# Altium schematic sheet S7CAS-PLEIADES-CARTE-MERE_P06_POWER.SCHDOC
size Tabloid; SheetNumber: 4; SheetTotal: 18; Sheet_Name: POWER; Size: 11x17
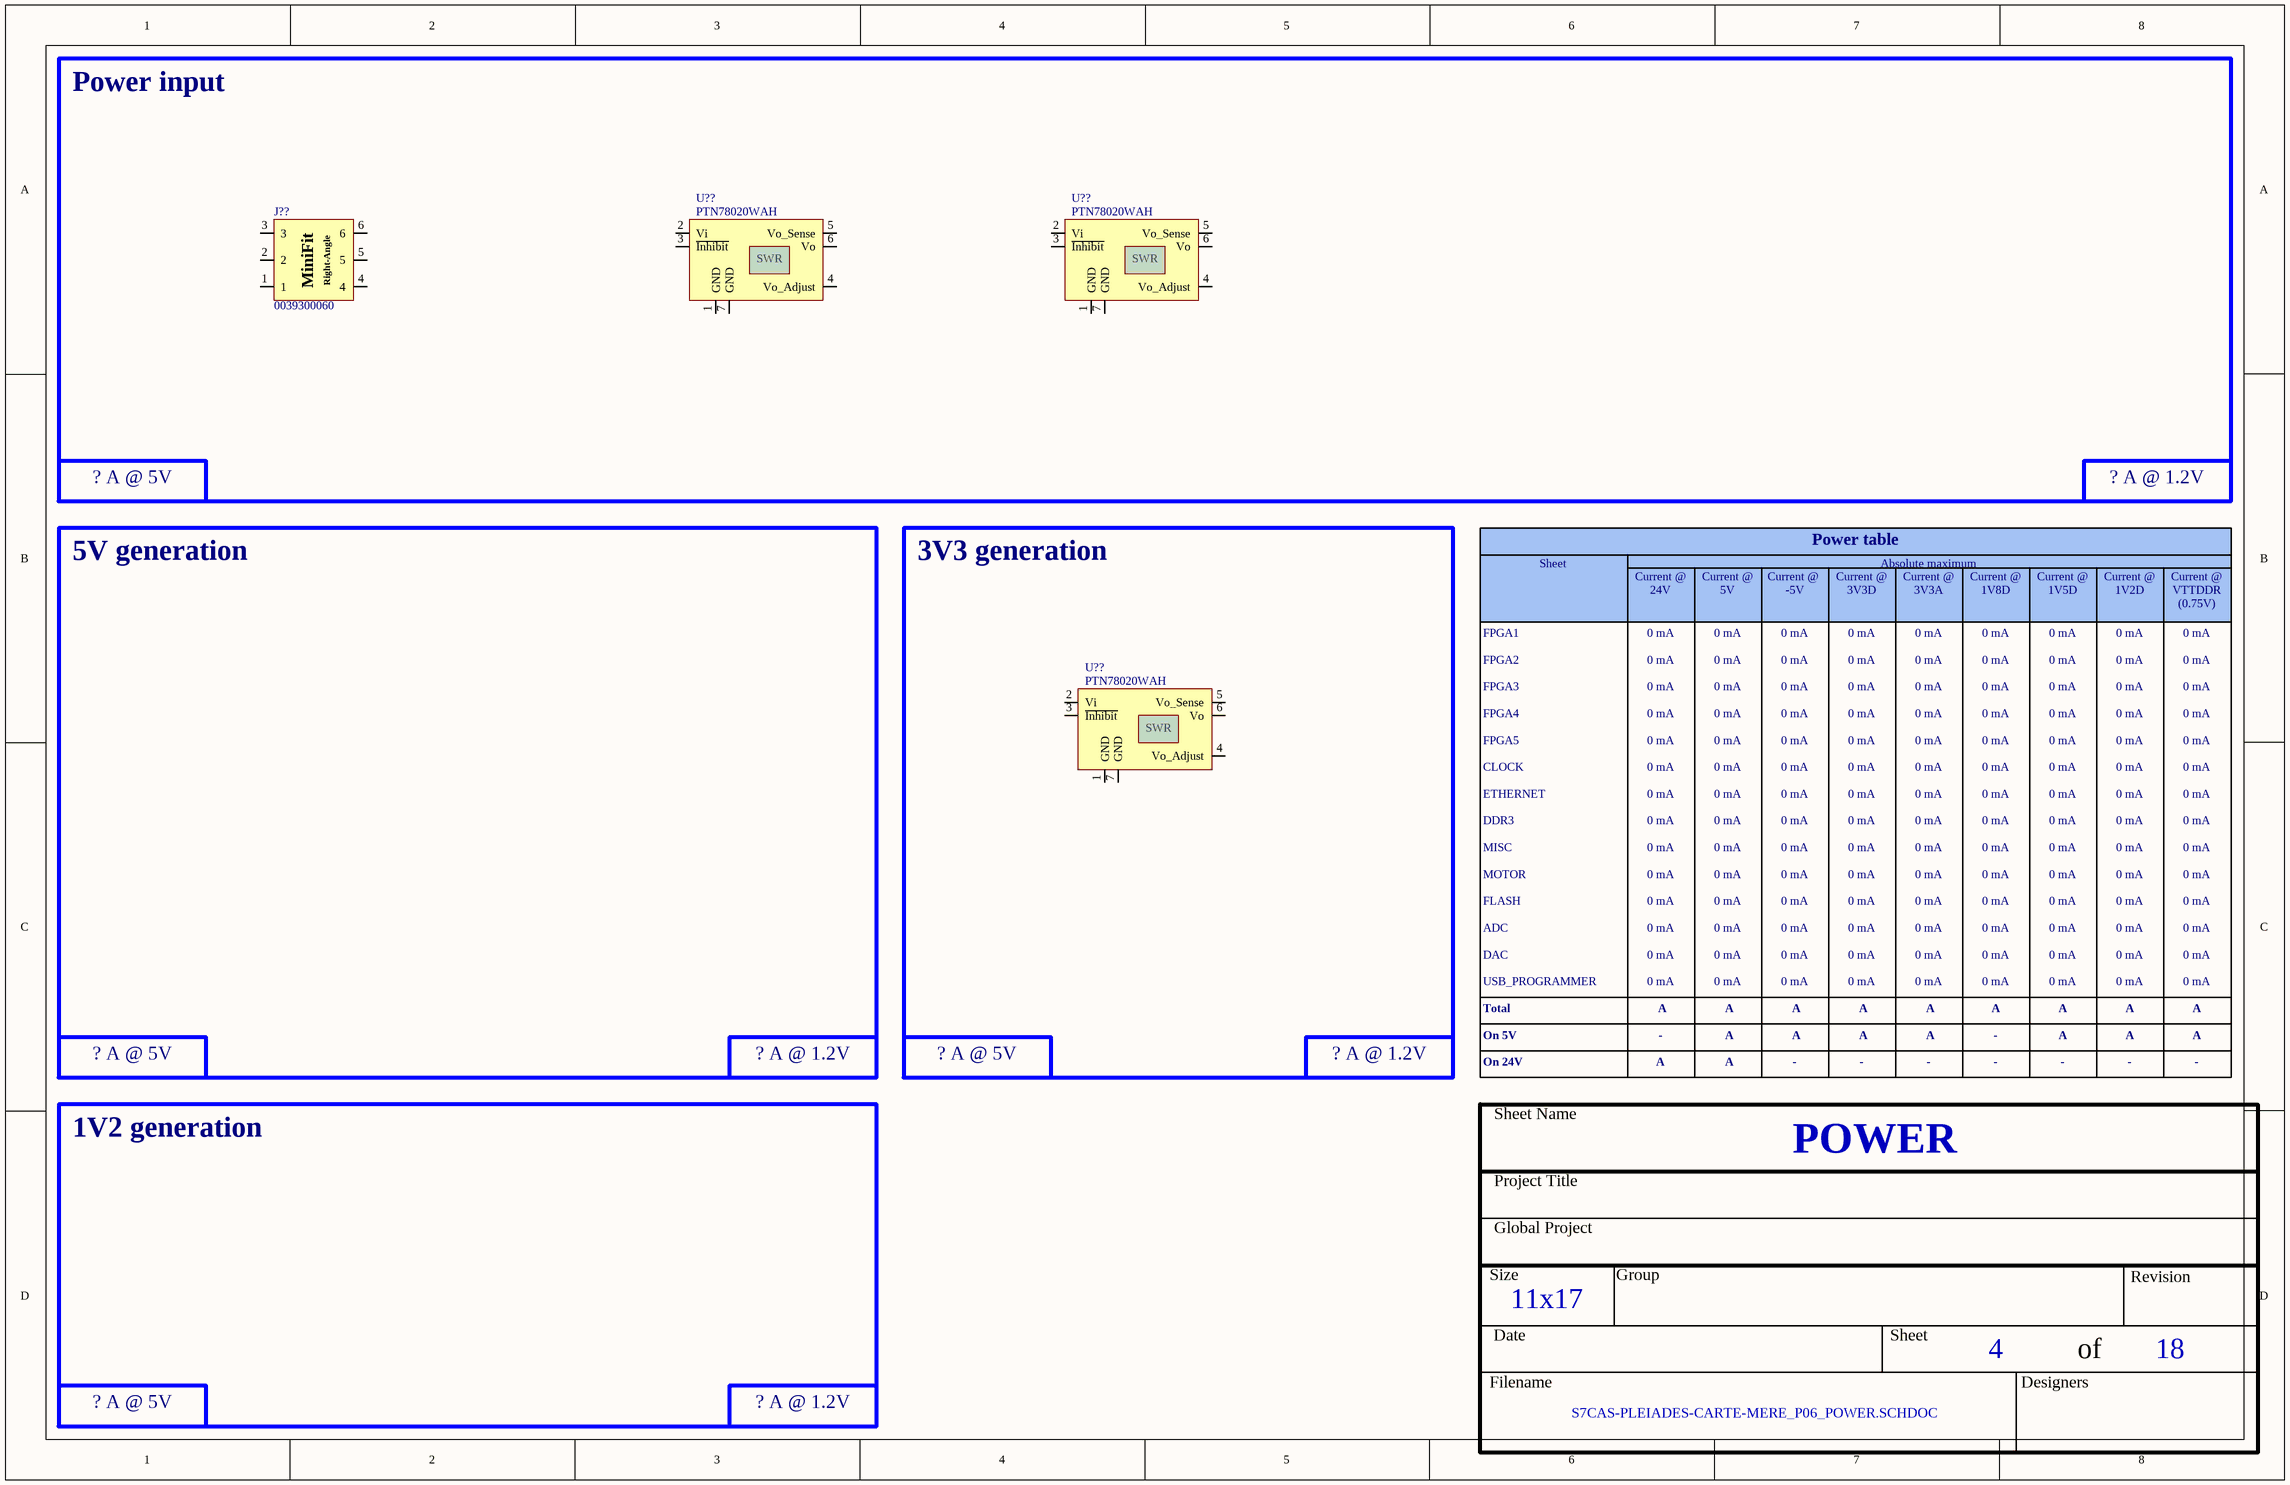
[diagram p0: S7CAS-PLEIADES-CARTE-MERE_P06_POWER.SCHDOC]

## Parts
(Parts that share a designator on the sheet are numbered #1, #2 ... from top to bottom, then left to right.)
J??  0039300060  [CON_MINIFIT_0039300060]
U??#1  PTN78020WAH  [REG_SWR_PTN78020WAH]
U??#2  PTN78020WAH  [REG_SWR_PTN78020WAH]
U??#3  PTN78020WAH  [REG_SWR_PTN78020WAH]

## Blocks framed on the sheet
Power input: J?? U??#1 U??#2
3V3 generation: U??#3

## Nets

Not connected (* = marked no-connect by the designer): J?? 1 2 3 4 5 6; U??#1 1(GND) 2(Vi) 3(~{Inhibit}) 4(Vo_Adjust) 5(Vo_Sense) 6(Vo) 7(GND); U??#2 1(GND) 2(Vi) 3(~{Inhibit}) 4(Vo_Adjust) 5(Vo_Sense) 6(Vo) 7(GND); U??#3 1(GND) 2(Vi) 3(~{Inhibit}) 4(Vo_Adjust) 5(Vo_Sense) 6(Vo) 7(GND)

## Notes on the sheet
- ? A @ 5V
- ? A @ 1.2V
- 5V generation
- Power table
- Absolute maximum
- Sheet
- Current @ 24V
- Current @ 5V
- Current @
  -5V
- Current @ 3V3D
- Current @ 3V3A
- Current @ 1V8D
- Current @ 1V5D
- Current @ 1V2D
- Current @ VTTDDR
  (0.75V)
- FPGA1
  FPGA2
  FPGA3
  FPGA4
  FPGA5
  CLOCK
  ETHERNET
  DDR3
  MISC
  MOTOR
  FLASH
  ADC
  DAC
  USB_PROGRAMMER
- Total
- 0 mA
  0 mA
  0 mA
  0 mA
  0 mA
  0 mA
  0 mA
  0 mA
  0 mA
  0 mA
  0 mA
  0 mA
  0 mA
  0 mA
- A
- On 5V
- On 24V
- -
- 1V2 generation
- Sheet Name
- Project Title
- Global Project
- Size
- Group
- Revision
- Date
- of
- Filename
- Designers
- (in symbol CON_MINIFIT_0039300060) MiniFit; Right-Angle
- (in symbol REG_SWR_PTN78020WAH) SWR

## Library data of the parts
J?? = CON_MINIFIT_0039300060: CON - Mini-Fit Through Hole, Right Angle 6 position; Manufacturer #1: Molex; Current Rating: 8A; GRAMS Lib Spec: 2.8; Magnetic Material: Unknown; Polarized: Yes; Voltage Rating: 600V; Assembly Type: TH; CreatedBy/Date: Joel Lemay 2018-06-21; HelpURL: https://www.molex.com/pdm_docs/sd/039300060_sd.pdf; Manufacturer #2: *; Package: TH; Part Number #1: 0039300060; Part Number #2: *; Power Max: *; Supplier 1: Digi-Key; Supplier Part Number 1: WM21353-ND; Temperature: - 40°C to + 80°C; Tolerance: *; Value: *; VerifiedBy: Caroline Paulin - 10 sept 2018; Cryo: UNKNOWN
U??#1-U??#3 = REG_SWR_PTN78020WAH: REG - DC DC CONVERTER 2.5-12.6V 6A - TH; Manufacturer #1: Texas Instruments; Value: 7V ~ 36V -> 2.5 ~ 12.6V; Voltage Rating: 36V; Power Max: 90 W; GRAMS Lib Spec: 2.8; Magnetic Material: Yes; Cryo: UNKNOWN; Tolerance: -; Current Rating: 6A; HelpURL: http://www.ti.com/lit/ds/symlink/ptn78020h.pdf; CreatedBy/Date: Arnaud_Samson_2019-07-09; VerifiedBy: c.Paulin - 15 juillet 2019; Temperature: -40°C ~ 85°C; Package: TH; Manufacturer #2: -; Assembly Type: TH; Part Number #2: -; Part Number #1: PTN78020WAH; Polarized: Yes; Supplier 1: Digi-Key; Supplier Part Number 1: 296-20515-ND